# EAGLE schematic lil_rgb (EAGLE 5.10)

## Sheet 1 of 3
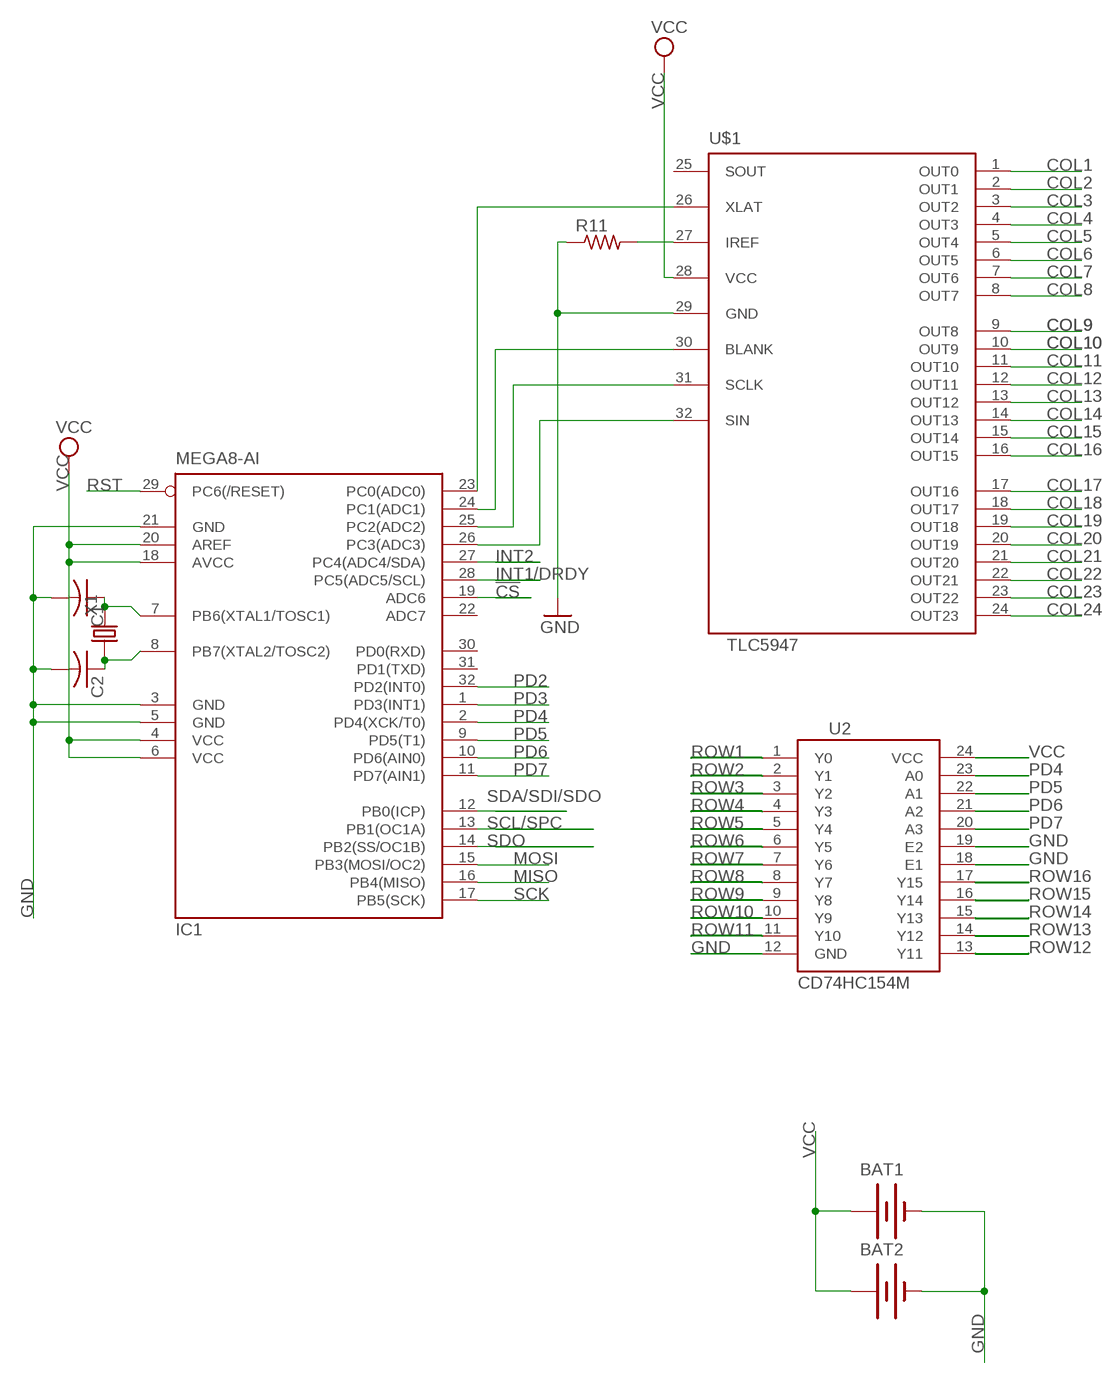
[diagram p0: schematic, sheet 1]

### Parts
BAT1  BATTERY20SMD  [BATTCON_20MM]
BAT2  BATTERY20SMD  [BATTCON_20MM]
C1  C-USC0805  [C0805]
C2  C-USC0805  [C0805]
IC1  MEGA8-AI  [TQFP32-08]
R11  R-US_R0805  [R0805]
U2  CD74HC154M  [SO-24DW]
U$1  TLC5947  [QFN32]
X1  CRYSTAL-5032  [5032]

### Nets
!CS: IC1.19(ADC6) ; also sheet 3
COL1: U$1.1(OUT0) ; also sheet 2
COL2: U$1.2(OUT1) ; also sheet 2
COL3: U$1.3(OUT2) ; also sheet 2
COL4: U$1.4(OUT3) ; also sheet 2
COL5: U$1.5(OUT4) ; also sheet 2
COL6: U$1.6(OUT5) ; also sheet 2
COL7: U$1.7(OUT6) ; also sheet 2
COL8: U$1.8(OUT7) ; also sheet 2
COL9: U$1.9(OUT8) ; also sheet 2
COL10: U$1.10(OUT9) ; also sheet 2
COL11: U$1.11(OUT10) ; also sheet 2
COL12: U$1.12(OUT11) ; also sheet 2
COL13: U$1.13(OUT12) ; also sheet 2
COL14: U$1.14(OUT13) ; also sheet 2
COL15: U$1.15(OUT14) ; also sheet 2
COL16: U$1.16(OUT15) ; also sheet 2
COL17: U$1.17(OUT16) ; also sheet 2
COL18: U$1.18(OUT17) ; also sheet 2
COL19: U$1.19(OUT18) ; also sheet 2
COL20: U$1.20(OUT19) ; also sheet 2
COL21: U$1.21(OUT20) ; also sheet 2
COL22: U$1.22(OUT21) ; also sheet 2
COL23: U$1.23(OUT22) ; also sheet 2
COL24: U$1.24(OUT23) ; also sheet 2
GND: BAT1.2(-) BAT2.2(-) C1.2 C2.2 IC1.3(GND) IC1.5(GND) IC1.21(GND) R11.1 U2.12(GND) U2.18(E1) U2.19(E2) U$1.29(GND) ; also sheet 3
INT1/DRDY: IC1.28(PC5(ADC5/SCL)) ; also sheet 3
INT2: IC1.27(PC4(ADC4/SDA)) ; also sheet 3
MISO: IC1.16(PB4(MISO)) ; also sheet 3
MOSI: IC1.15(PB3(MOSI/OC2)) ; also sheet 3
N$7: C1.1 IC1.7(PB6(XTAL1/TOSC1)) X1.2
N$8: C2.1 IC1.8(PB7(XTAL2/TOSC2)) X1.1
N$9: IC1.23(PC0(ADC0)) U$1.26(XLAT)
N$10: IC1.24(PC1(ADC1)) U$1.30(BLANK)
N$11: IC1.25(PC2(ADC2)) U$1.31(SCLK)
N$12: IC1.26(PC3(ADC3)) U$1.32(SIN)
N$13: R11.2 U$1.27(IREF)
PD2: IC1.32(PD2(INT0)) ; also sheet 3
PD3: IC1.1(PD3(INT1)) ; also sheet 3
PD4: IC1.2(PD4(XCK/T0)) U2.23(A0)
PD5: IC1.9(PD5(T1)) U2.22(A1)
PD6: IC1.10(PD6(AIN0)) U2.21(A2)
PD7: IC1.11(PD7(AIN1)) U2.20(A3)
ROW1: U2.1(Y0) ; also sheet 2
ROW2: U2.2(Y1) ; also sheet 2
ROW3: U2.3(Y2) ; also sheet 2
ROW4: U2.4(Y3) ; also sheet 2
ROW5: U2.5(Y4) ; also sheet 2
ROW6: U2.6(Y5) ; also sheet 2
ROW7: U2.7(Y6) ; also sheet 2
ROW8: U2.8(Y7) ; also sheet 2
ROW9: U2.9(Y8) ; also sheet 2
ROW10: U2.10(Y9)
ROW11: U2.11(Y10)
ROW12: U2.13(Y11)
ROW13: U2.14(Y12)
ROW14: U2.15(Y13)
ROW15: U2.16(Y14)
ROW16: U2.17(Y15)
RST: IC1.29(PC6(/RESET)) ; also sheet 3
SCK: IC1.17(PB5(SCK)) ; also sheet 3
SCL/SPC: IC1.13(PB1(OC1A)) ; also sheet 3
SDA/SDI/SDO: IC1.12(PB0(ICP)) ; also sheet 3
SDO: IC1.14(PB2(SS/OC1B)) ; also sheet 3
VCC: BAT1.1(+) BAT2.1(+) IC1.4(VCC) IC1.6(VCC) IC1.18(AVCC) IC1.20(AREF) U2.24(VCC) U$1.28(VCC) ; also sheet 2,3
Unconnected: IC1.22(ADC7) IC1.30(PD0(RXD)) IC1.31(PD1(TXD)) U$1.25(SOUT)

## Sheet 2 of 3
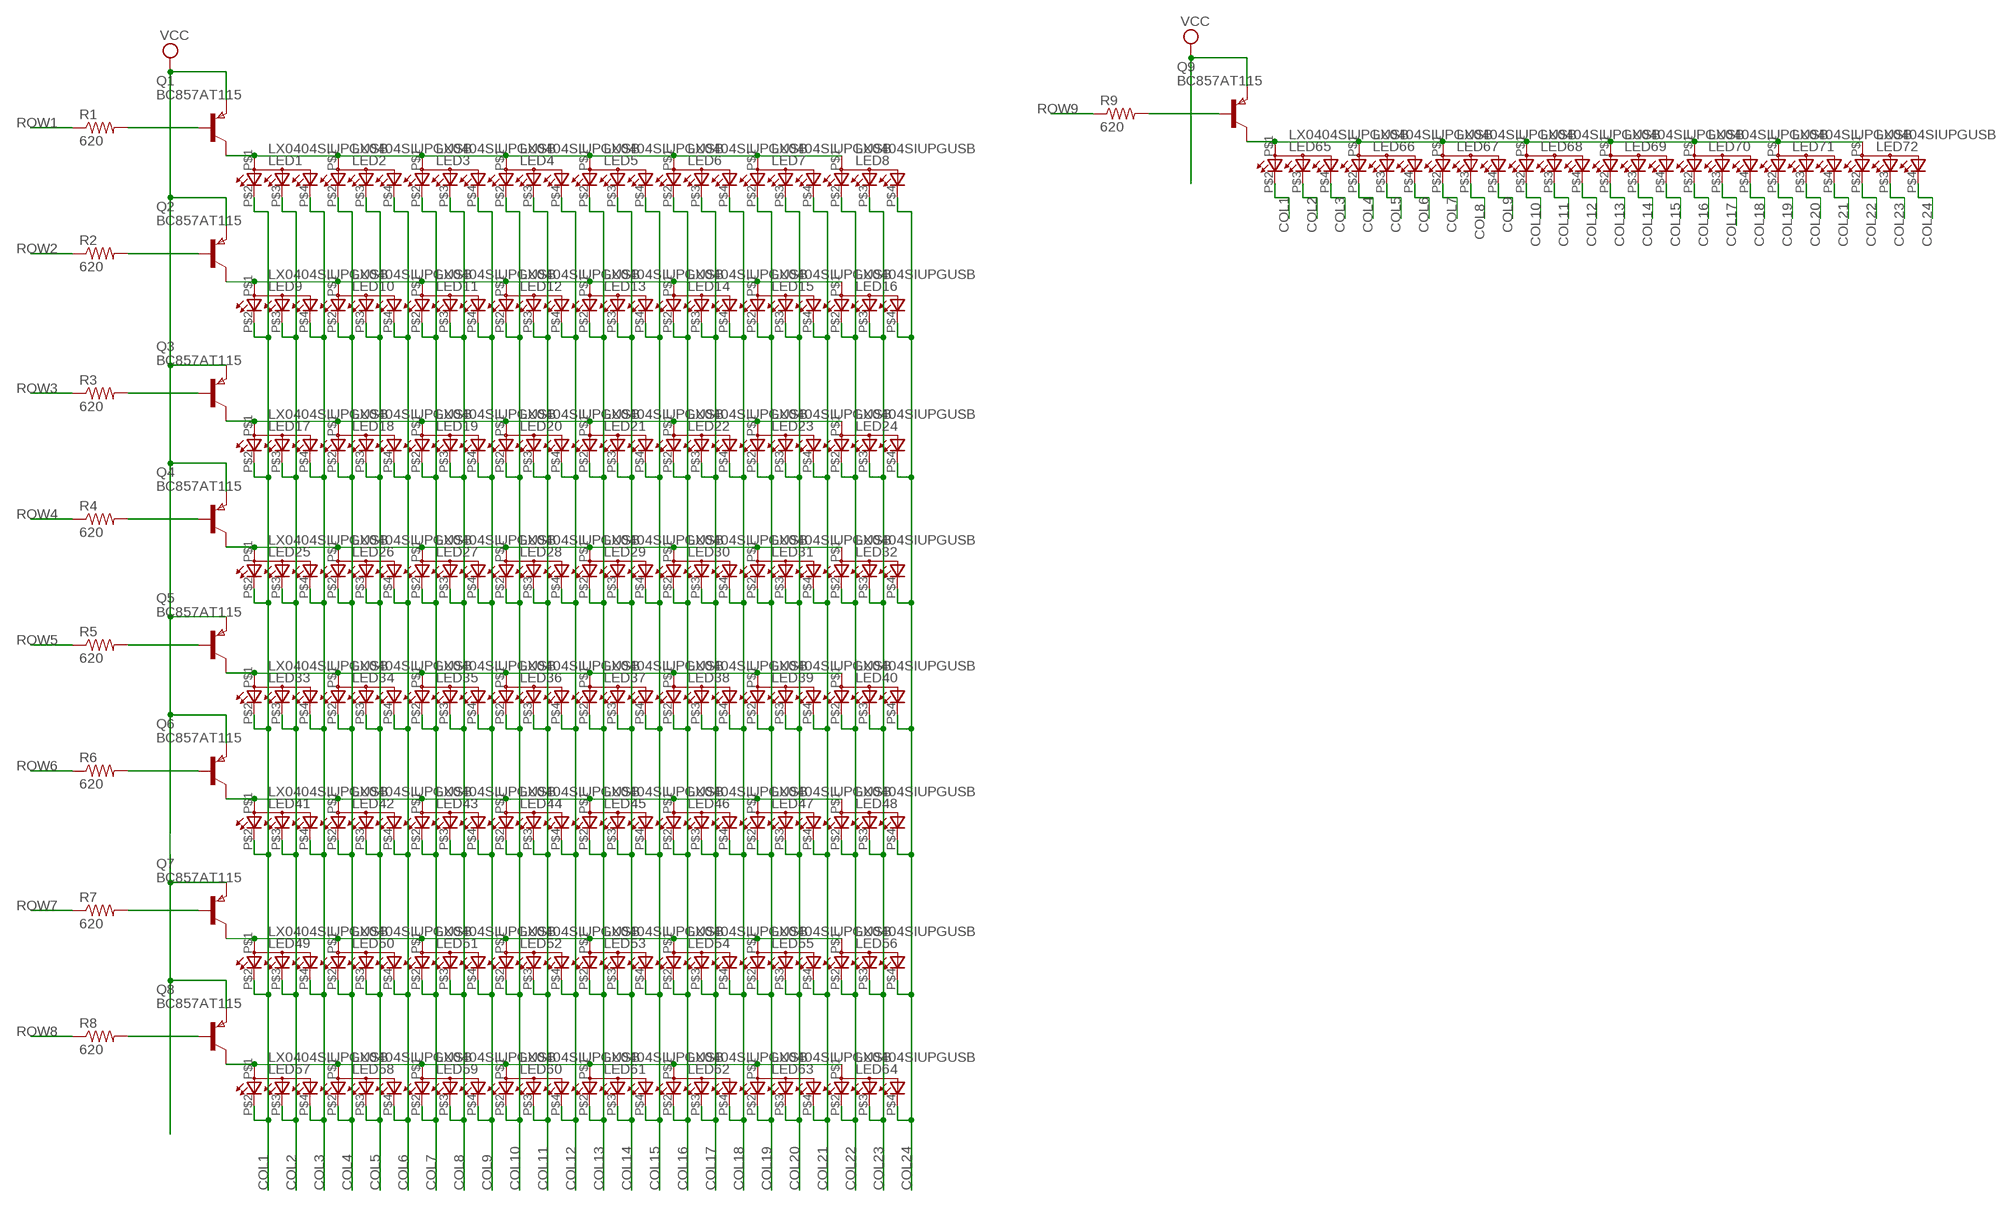
[diagram p1: schematic, sheet 2]

### Parts
LED1  LX0404SIUPGUSB  [0404_LED]
LED2  LX0404SIUPGUSB  [0404_LED]
LED3  LX0404SIUPGUSB  [0404_LED]
LED4  LX0404SIUPGUSB  [0404_LED]
LED5  LX0404SIUPGUSB  [0404_LED]
LED6  LX0404SIUPGUSB  [0404_LED]
LED7  LX0404SIUPGUSB  [0404_LED]
LED8  LX0404SIUPGUSB  [0404_LED]
LED9  LX0404SIUPGUSB  [0404_LED]
LED10  LX0404SIUPGUSB  [0404_LED]
LED11  LX0404SIUPGUSB  [0404_LED]
LED12  LX0404SIUPGUSB  [0404_LED]
LED13  LX0404SIUPGUSB  [0404_LED]
LED14  LX0404SIUPGUSB  [0404_LED]
LED15  LX0404SIUPGUSB  [0404_LED]
LED16  LX0404SIUPGUSB  [0404_LED]
LED17  LX0404SIUPGUSB  [0404_LED]
LED18  LX0404SIUPGUSB  [0404_LED]
LED19  LX0404SIUPGUSB  [0404_LED]
LED20  LX0404SIUPGUSB  [0404_LED]
LED21  LX0404SIUPGUSB  [0404_LED]
LED22  LX0404SIUPGUSB  [0404_LED]
LED23  LX0404SIUPGUSB  [0404_LED]
LED24  LX0404SIUPGUSB  [0404_LED]
LED25  LX0404SIUPGUSB  [0404_LED]
LED26  LX0404SIUPGUSB  [0404_LED]
LED27  LX0404SIUPGUSB  [0404_LED]
LED28  LX0404SIUPGUSB  [0404_LED]
LED29  LX0404SIUPGUSB  [0404_LED]
LED30  LX0404SIUPGUSB  [0404_LED]
LED31  LX0404SIUPGUSB  [0404_LED]
LED32  LX0404SIUPGUSB  [0404_LED]
LED33  LX0404SIUPGUSB  [0404_LED]
LED34  LX0404SIUPGUSB  [0404_LED]
LED35  LX0404SIUPGUSB  [0404_LED]
LED36  LX0404SIUPGUSB  [0404_LED]
LED37  LX0404SIUPGUSB  [0404_LED]
LED38  LX0404SIUPGUSB  [0404_LED]
LED39  LX0404SIUPGUSB  [0404_LED]
LED40  LX0404SIUPGUSB  [0404_LED]
LED41  LX0404SIUPGUSB  [0404_LED]
LED42  LX0404SIUPGUSB  [0404_LED]
LED43  LX0404SIUPGUSB  [0404_LED]
LED44  LX0404SIUPGUSB  [0404_LED]
LED45  LX0404SIUPGUSB  [0404_LED]
LED46  LX0404SIUPGUSB  [0404_LED]
LED47  LX0404SIUPGUSB  [0404_LED]
LED48  LX0404SIUPGUSB  [0404_LED]
LED49  LX0404SIUPGUSB  [0404_LED]
LED50  LX0404SIUPGUSB  [0404_LED]
LED51  LX0404SIUPGUSB  [0404_LED]
LED52  LX0404SIUPGUSB  [0404_LED]
LED53  LX0404SIUPGUSB  [0404_LED]
LED54  LX0404SIUPGUSB  [0404_LED]
LED55  LX0404SIUPGUSB  [0404_LED]
LED56  LX0404SIUPGUSB  [0404_LED]
LED57  LX0404SIUPGUSB  [0404_LED]
LED58  LX0404SIUPGUSB  [0404_LED]
LED59  LX0404SIUPGUSB  [0404_LED]
LED60  LX0404SIUPGUSB  [0404_LED]
LED61  LX0404SIUPGUSB  [0404_LED]
LED62  LX0404SIUPGUSB  [0404_LED]
LED63  LX0404SIUPGUSB  [0404_LED]
LED64  LX0404SIUPGUSB  [0404_LED]
LED65  LX0404SIUPGUSB  [0404_LED]
LED66  LX0404SIUPGUSB  [0404_LED]
LED67  LX0404SIUPGUSB  [0404_LED]
LED68  LX0404SIUPGUSB  [0404_LED]
LED69  LX0404SIUPGUSB  [0404_LED]
LED70  LX0404SIUPGUSB  [0404_LED]
LED71  LX0404SIUPGUSB  [0404_LED]
LED72  LX0404SIUPGUSB  [0404_LED]
Q1  BC857AT115  PNPSOT323SOT416  [SOT416]
Q2  BC857AT115  PNPSOT323SOT416  [SOT416]
Q3  BC857AT115  PNPSOT323SOT416  [SOT416]
Q4  BC857AT115  PNPSOT323SOT416  [SOT416]
Q5  BC857AT115  PNPSOT323SOT416  [SOT416]
Q6  BC857AT115  PNPSOT323SOT416  [SOT416]
Q7  BC857AT115  PNPSOT323SOT416  [SOT416]
Q8  BC857AT115  PNPSOT323SOT416  [SOT416]
Q9  BC857AT115  PNPSOT323SOT416  [SOT416]
R1  620  SPARKFUN_RESISTOR0603-RES  [SPARKFUN_0603-RES]
R2  620  SPARKFUN_RESISTOR0603-RES  [SPARKFUN_0603-RES]
R3  620  SPARKFUN_RESISTOR0603-RES  [SPARKFUN_0603-RES]
R4  620  SPARKFUN_RESISTOR0603-RES  [SPARKFUN_0603-RES]
R5  620  SPARKFUN_RESISTOR0603-RES  [SPARKFUN_0603-RES]
R6  620  SPARKFUN_RESISTOR0603-RES  [SPARKFUN_0603-RES]
R7  620  SPARKFUN_RESISTOR0603-RES  [SPARKFUN_0603-RES]
R8  620  SPARKFUN_RESISTOR0603-RES  [SPARKFUN_0603-RES]
R9  620  SPARKFUN_RESISTOR0603-RES  [SPARKFUN_0603-RES]

### Nets
COL1: LED1.P$2(CRED) LED9.P$2(CRED) LED17.P$2(CRED) LED25.P$2(CRED) LED33.P$2(CRED) LED41.P$2(CRED) LED49.P$2(CRED) LED57.P$2(CRED) LED65.P$2(CRED) ; also sheet 1
COL2: LED1.P$3(CBLUE) LED9.P$3(CBLUE) LED17.P$3(CBLUE) LED25.P$3(CBLUE) LED33.P$3(CBLUE) LED41.P$3(CBLUE) LED49.P$3(CBLUE) LED57.P$3(CBLUE) LED65.P$3(CBLUE) ; also sheet 1
COL3: LED1.P$4(CGREEN) LED9.P$4(CGREEN) LED17.P$4(CGREEN) LED25.P$4(CGREEN) LED33.P$4(CGREEN) LED41.P$4(CGREEN) LED49.P$4(CGREEN) LED57.P$4(CGREEN) LED65.P$4(CGREEN) ; also sheet 1
COL4: LED2.P$2(CRED) LED10.P$2(CRED) LED18.P$2(CRED) LED26.P$2(CRED) LED34.P$2(CRED) LED42.P$2(CRED) LED50.P$2(CRED) LED58.P$2(CRED) LED66.P$2(CRED) ; also sheet 1
COL5: LED2.P$3(CBLUE) LED10.P$3(CBLUE) LED18.P$3(CBLUE) LED26.P$3(CBLUE) LED34.P$3(CBLUE) LED42.P$3(CBLUE) LED50.P$3(CBLUE) LED58.P$3(CBLUE) LED66.P$3(CBLUE) ; also sheet 1
COL6: LED2.P$4(CGREEN) LED10.P$4(CGREEN) LED18.P$4(CGREEN) LED26.P$4(CGREEN) LED34.P$4(CGREEN) LED42.P$4(CGREEN) LED50.P$4(CGREEN) LED58.P$4(CGREEN) LED66.P$4(CGREEN) ; also sheet 1
COL7: LED3.P$2(CRED) LED11.P$2(CRED) LED19.P$2(CRED) LED27.P$2(CRED) LED35.P$2(CRED) LED43.P$2(CRED) LED51.P$2(CRED) LED59.P$2(CRED) LED67.P$2(CRED) ; also sheet 1
COL8: LED3.P$3(CBLUE) LED11.P$3(CBLUE) LED19.P$3(CBLUE) LED27.P$3(CBLUE) LED35.P$3(CBLUE) LED43.P$3(CBLUE) LED51.P$3(CBLUE) LED59.P$3(CBLUE) LED67.P$3(CBLUE) ; also sheet 1
COL9: LED3.P$4(CGREEN) LED11.P$4(CGREEN) LED19.P$4(CGREEN) LED27.P$4(CGREEN) LED35.P$4(CGREEN) LED43.P$4(CGREEN) LED51.P$4(CGREEN) LED59.P$4(CGREEN) LED67.P$4(CGREEN) ; also sheet 1
COL10: LED4.P$2(CRED) LED12.P$2(CRED) LED20.P$2(CRED) LED28.P$2(CRED) LED36.P$2(CRED) LED44.P$2(CRED) LED52.P$2(CRED) LED60.P$2(CRED) LED68.P$2(CRED) ; also sheet 1
COL11: LED4.P$3(CBLUE) LED12.P$3(CBLUE) LED20.P$3(CBLUE) LED28.P$3(CBLUE) LED36.P$3(CBLUE) LED44.P$3(CBLUE) LED52.P$3(CBLUE) LED60.P$3(CBLUE) LED68.P$3(CBLUE) ; also sheet 1
COL12: LED4.P$4(CGREEN) LED12.P$4(CGREEN) LED20.P$4(CGREEN) LED28.P$4(CGREEN) LED36.P$4(CGREEN) LED44.P$4(CGREEN) LED52.P$4(CGREEN) LED60.P$4(CGREEN) LED68.P$4(CGREEN) ; also sheet 1
COL13: LED5.P$2(CRED) LED13.P$2(CRED) LED21.P$2(CRED) LED29.P$2(CRED) LED37.P$2(CRED) LED45.P$2(CRED) LED53.P$2(CRED) LED61.P$2(CRED) LED69.P$2(CRED) ; also sheet 1
COL14: LED5.P$3(CBLUE) LED13.P$3(CBLUE) LED21.P$3(CBLUE) LED29.P$3(CBLUE) LED37.P$3(CBLUE) LED45.P$3(CBLUE) LED53.P$3(CBLUE) LED61.P$3(CBLUE) LED69.P$3(CBLUE) ; also sheet 1
COL15: LED5.P$4(CGREEN) LED13.P$4(CGREEN) LED21.P$4(CGREEN) LED29.P$4(CGREEN) LED37.P$4(CGREEN) LED45.P$4(CGREEN) LED53.P$4(CGREEN) LED61.P$4(CGREEN) LED69.P$4(CGREEN) ; also sheet 1
COL16: LED6.P$2(CRED) LED14.P$2(CRED) LED22.P$2(CRED) LED30.P$2(CRED) LED38.P$2(CRED) LED46.P$2(CRED) LED54.P$2(CRED) LED62.P$2(CRED) LED70.P$2(CRED) ; also sheet 1
COL17: LED6.P$3(CBLUE) LED14.P$3(CBLUE) LED22.P$3(CBLUE) LED30.P$3(CBLUE) LED38.P$3(CBLUE) LED46.P$3(CBLUE) LED54.P$3(CBLUE) LED62.P$3(CBLUE) LED70.P$3(CBLUE) ; also sheet 1
COL18: LED6.P$4(CGREEN) LED14.P$4(CGREEN) LED22.P$4(CGREEN) LED30.P$4(CGREEN) LED38.P$4(CGREEN) LED46.P$4(CGREEN) LED54.P$4(CGREEN) LED62.P$4(CGREEN) LED70.P$4(CGREEN) ; also sheet 1
COL19: LED7.P$2(CRED) LED15.P$2(CRED) LED23.P$2(CRED) LED31.P$2(CRED) LED39.P$2(CRED) LED47.P$2(CRED) LED55.P$2(CRED) LED63.P$2(CRED) LED71.P$2(CRED) ; also sheet 1
COL20: LED7.P$3(CBLUE) LED15.P$3(CBLUE) LED23.P$3(CBLUE) LED31.P$3(CBLUE) LED39.P$3(CBLUE) LED47.P$3(CBLUE) LED55.P$3(CBLUE) LED63.P$3(CBLUE) LED71.P$3(CBLUE) ; also sheet 1
COL21: LED7.P$4(CGREEN) LED15.P$4(CGREEN) LED23.P$4(CGREEN) LED31.P$4(CGREEN) LED39.P$4(CGREEN) LED47.P$4(CGREEN) LED55.P$4(CGREEN) LED63.P$4(CGREEN) LED71.P$4(CGREEN) ; also sheet 1
COL22: LED8.P$2(CRED) LED16.P$2(CRED) LED24.P$2(CRED) LED32.P$2(CRED) LED40.P$2(CRED) LED48.P$2(CRED) LED56.P$2(CRED) LED64.P$2(CRED) LED72.P$2(CRED) ; also sheet 1
COL23: LED8.P$3(CBLUE) LED16.P$3(CBLUE) LED24.P$3(CBLUE) LED32.P$3(CBLUE) LED40.P$3(CBLUE) LED48.P$3(CBLUE) LED56.P$3(CBLUE) LED64.P$3(CBLUE) LED72.P$3(CBLUE) ; also sheet 1
COL24: LED8.P$4(CGREEN) LED16.P$4(CGREEN) LED24.P$4(CGREEN) LED32.P$4(CGREEN) LED40.P$4(CGREEN) LED48.P$4(CGREEN) LED56.P$4(CGREEN) LED64.P$4(CGREEN) LED72.P$4(CGREEN) ; also sheet 1
LINE1: LED1.P$1(A) LED2.P$1(A) LED3.P$1(A) LED4.P$1(A) LED5.P$1(A) LED6.P$1(A) LED7.P$1(A) LED8.P$1(A) Q1.1(C)
LINE2: LED9.P$1(A) LED10.P$1(A) LED11.P$1(A) LED12.P$1(A) LED13.P$1(A) LED14.P$1(A) LED15.P$1(A) LED16.P$1(A) Q2.1(C)
LINE4: LED17.P$1(A) LED18.P$1(A) LED19.P$1(A) LED20.P$1(A) LED21.P$1(A) LED22.P$1(A) LED23.P$1(A) LED24.P$1(A) Q3.1(C)
LINE6: LED25.P$1(A) LED26.P$1(A) LED27.P$1(A) LED28.P$1(A) LED29.P$1(A) LED30.P$1(A) LED31.P$1(A) LED32.P$1(A) Q4.1(C)
LINE8: LED33.P$1(A) LED34.P$1(A) LED35.P$1(A) LED36.P$1(A) LED37.P$1(A) LED38.P$1(A) LED39.P$1(A) LED40.P$1(A) Q5.1(C)
LINE11: LED41.P$1(A) LED42.P$1(A) LED43.P$1(A) LED44.P$1(A) LED45.P$1(A) LED46.P$1(A) LED47.P$1(A) LED48.P$1(A) Q6.1(C)
LINE13: LED49.P$1(A) LED50.P$1(A) LED51.P$1(A) LED52.P$1(A) LED53.P$1(A) LED54.P$1(A) LED55.P$1(A) LED56.P$1(A) Q7.1(C)
LINE15: LED57.P$1(A) LED58.P$1(A) LED59.P$1(A) LED60.P$1(A) LED61.P$1(A) LED62.P$1(A) LED63.P$1(A) LED64.P$1(A) Q8.1(C)
LINE17: LED65.P$1(A) LED66.P$1(A) LED67.P$1(A) LED68.P$1(A) LED69.P$1(A) LED70.P$1(A) LED71.P$1(A) LED72.P$1(A) Q9.1(C)
N$1: Q2.2(B) R2.2
N$2: Q1.2(B) R1.2
N$3: Q5.2(B) R5.2
N$4: Q9.2(B) R9.2
N$52: Q6.2(B) R6.2
N$53: Q7.2(B) R7.2
N$54: Q8.2(B) R8.2
N$69: Q3.2(B) R3.2
N$94: Q4.2(B) R4.2
ROW1: R1.1 ; also sheet 1
ROW2: R2.1 ; also sheet 1
ROW3: R3.1 ; also sheet 1
ROW4: R4.1 ; also sheet 1
ROW5: R5.1 ; also sheet 1
ROW6: R6.1 ; also sheet 1
ROW7: R7.1 ; also sheet 1
ROW8: R8.1 ; also sheet 1
ROW9: R9.1 ; also sheet 1
VCC: Q1.3(E) Q2.3(E) Q3.3(E) Q4.3(E) Q5.3(E) Q6.3(E) Q7.3(E) Q8.3(E) Q9.3(E) ; also sheet 1,3

## Sheet 3 of 3
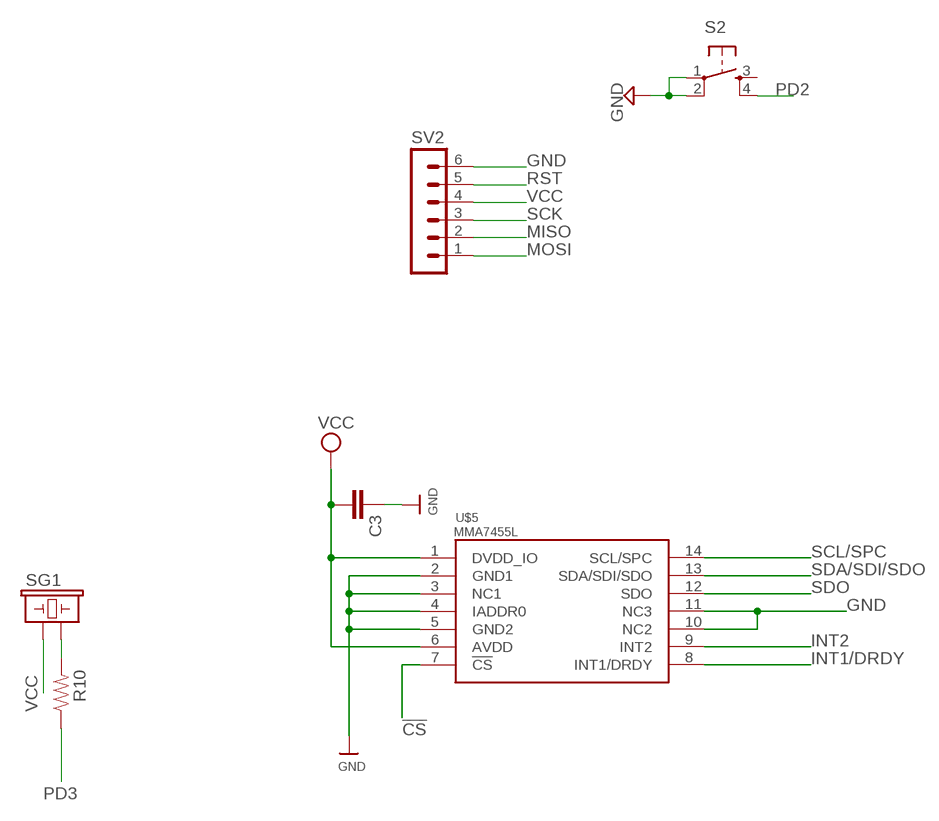
[diagram p2: schematic, sheet 3]

### Parts
C3  CAP0805  [0805]
R10  RESISTOR1206  [1206]
S2  TAC_SWITCHSMD  [TACTILE_SWITCH_SMD]
SG1  BUZZERSMD2  [BUZZER-CCV]
SV2  MA06-1  [MA06-1]
U$5  MMA7455L  [LGA-14]

### Nets
!CS: U$5.7(!CS) ; also sheet 1
GND: C3.1 S2.1 S2.2 SV2.6 U$5.2(GND1) U$5.3(NC1) U$5.4(IADDR0) U$5.5(GND2) U$5.10(NC2) U$5.11(NC3) ; also sheet 1
INT1/DRDY: U$5.8(INT1/DRDY) ; also sheet 1
INT2: U$5.9(INT2) ; also sheet 1
MISO: SV2.2 ; also sheet 1
MOSI: SV2.1 ; also sheet 1
N$5: R10.2 SG1.-
PD2: S2.4 ; also sheet 1
PD3: R10.1 ; also sheet 1
RST: SV2.5 ; also sheet 1
SCK: SV2.3 ; also sheet 1
SCL/SPC: U$5.14(SCL/SPC) ; also sheet 1
SDA/SDI/SDO: U$5.13(SDA/SDI/SDO) ; also sheet 1
SDO: U$5.12(SDO) ; also sheet 1
VCC: C3.2 SG1.+ SV2.4 U$5.1(DVDD_IO) U$5.6(AVDD) ; also sheet 1,2
Unconnected: S2.3

## Library data of the parts
BAT1 BAT2 = SparkFun:BATTERY: Battery Holders Various common sizes : AA, AAA, 20mm coin cell and 12mm coin cell.
C1 C2 = rcl:C-US: CAPACITOR, American symbol
C3 = SparkFun:CAP: Capacitor Standard 0603 ceramic capacitor, and 0.1" leaded capacitor.
IC1 = atmel:MEGA8: MICROCONTROLLER 8 Kbytes FLASH, 1 kbytes SRAM, 512 bytes EEPROM, USART, 6-channel 10 bit ADC, 2-channel 8 bit ADC Pin compatible with Atmega48, ATMega88, ATMega168 Source: avr.lbr; MPN: ATMEGA8-16AU; OC_FARNELL: 9171371; OC_NEWARK: 73M8863
LED1-LED72 = 0404_RGB_LED:LX0404SIUPGUSB
Q1-Q9 = zetex:PNPSOT323: PNP TRANSISTOR
R1-R9 = Nullspace:SPARKFUN_RESISTOR: Resistor Basic schematic elements and footprints for 0603, 1206, and PTH 1/10th watt (small) resistors.
R10 = SparkFun:RESISTOR: Resistor Basic schematic elements and footprints for 0603, 1206, and PTH 1/10th watt (small) resistors.
R11 = rcl:R-US_: RESISTOR, American symbol
S2 = SparkFun:TAC_SWITCH: Momentary Switch Button commonly used for reset or general input. Spark Fun Electronics SKU : COM-00097
SG1 = SparkFun:BUZZER: Buzzer 12mm Spark Fun Electronics SKU : Comp-Buzzer
SV2 = NSL:MA06-1: PIN HEADER
U2 = SparkFun:CD74HC154M: High-Speed CMOS Logic 4- to 16-Line Decoder/Demultiplexer
U$1 = lil_rgb:TLC5947
U$5 = MMA7455Lbreakoutboard-v1a:MMA7455L
X1 = NSL_MiniQuad:CRYSTAL*: CRYSTAL

## Net classes
0 default: width 0.254 mm